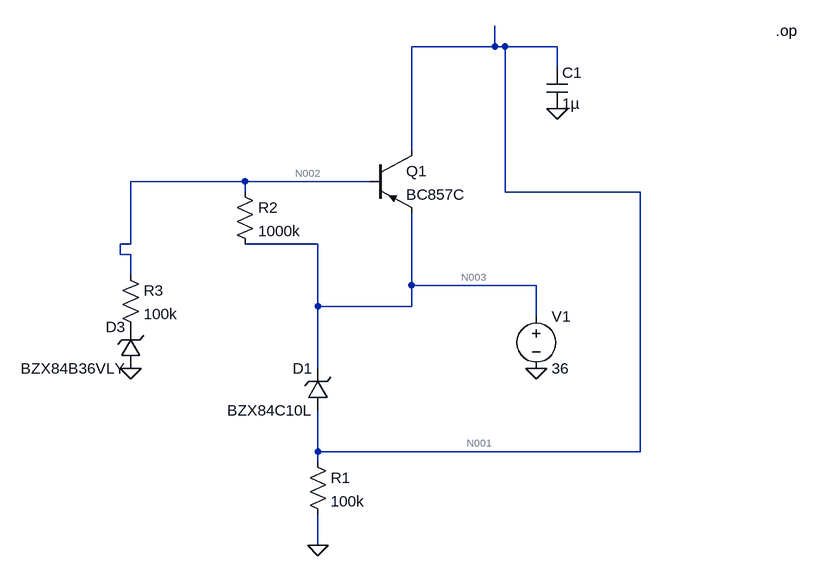
[diagram p0: schematic Schaltung_Zener.asc]
Schaltung_Zener.asc, the LTspice schematic file:
Version 4.1
SHEET 1 880 756
WIRE 384 -32 384 -64
WIRE 384 -32 256 -32
WIRE 400 -32 384 -32
WIRE 480 -32 400 -32
WIRE 480 0 480 -32
WIRE 256 128 256 -32
WIRE 0 176 -176 176
WIRE 192 176 0 176
WIRE 0 192 0 176
WIRE 400 192 400 -32
WIRE 608 192 400 192
WIRE -176 272 -176 176
WIRE -176 272 -192 272
WIRE 112 272 0 272
WIRE -192 288 -192 272
WIRE -176 288 -192 288
WIRE -176 320 -176 288
WIRE 256 336 256 224
WIRE 448 336 256 336
WIRE 112 368 112 272
WIRE 256 368 256 336
WIRE 256 368 112 368
WIRE 448 384 448 336
WIRE 112 464 112 368
WIRE 112 592 112 528
WIRE 608 592 608 192
WIRE 608 592 112 592
WIRE 112 608 112 592
WIRE 112 736 112 688
FLAG 112 736 0
FLAG 480 64 0
FLAG 448 464 0
FLAG -176 464 0
DATAFLAG 384 -64 "$-V(N003)"
DATAFLAG 160 176 "$-V(N003)"
DATAFLAG 160 176 "$-V(N003)"
SYMBOL pnp 192 128 R0
SYMATTR InstName Q1
SYMATTR Value BC857C
SYMBOL res 96 592 R0
SYMATTR InstName R1
SYMATTR Value 100k
SYMBOL cap 464 0 R0
SYMATTR InstName C1
SYMATTR Value 1µ
SYMBOL res -16 176 R0
SYMATTR InstName R2
SYMATTR Value 1000k
SYMBOL voltage 448 368 R0
WINDOW 123 0 0 Left 0
WINDOW 39 24 124 Left 2
SYMATTR InstName V1
SYMATTR Value 36
SYMBOL res -192 304 R0
SYMATTR InstName R3
SYMATTR Value 100k
SYMBOL zener 128 528 R180
WINDOW 0 24 64 Left 2
WINDOW 3 24 0 Left 2
SYMATTR InstName D1
SYMATTR Value BZX84C10L
SYMBOL zener -160 464 R180
WINDOW 0 24 64 Left 2
WINDOW 3 24 0 Left 2
SYMATTR InstName D3
SYMATTR Value BZX84B36VLY
TEXT 816 -56 Left 2 !.op

The netlist it stands for:
* Schaltung_Zener.asc
Q1 N001 N002 N003 0 BC857C
R1 N001 0 100k
C1 N001 0 1µ
R2 N002 N003 1000k
V1 N003 0 36
R3 N002 P001 100k
D1 N001 N003 BZX84C10L
D3 0 P001 BZX84B36VLY
.model D D
.lib standard.dio
.model NPN NPN
.model PNP PNP
.lib standard.bjt
.op
.backanno
.end

* Results of the author's LTspice run, read from the files saved beside the schematic
* Operating Point:
*   V(n002) = 35.94 V
*   V(p001) = 35.94 V
*   V(n001) = 26.17 V
*   V(n003) = 36 V
*   Ic(Q1) = -10.19 pA
*   Ib(Q1) = 9.708 pA
*   Ie(Q1) = 482.3 fA
*   Is(Q1) = 0 A
*   I(V1) = -261.8 µA
*   I(R3) = 57.07 nA
*   I(D3) = -57.07 nA
*   I(C1) = 0 A
*   I(R2) = -57.08 nA
*   I(R1) = 261.7 µA
*   I(D1) = -261.7 µA